# EAGLE schematic masterClock (EAGLE 9.0.0)
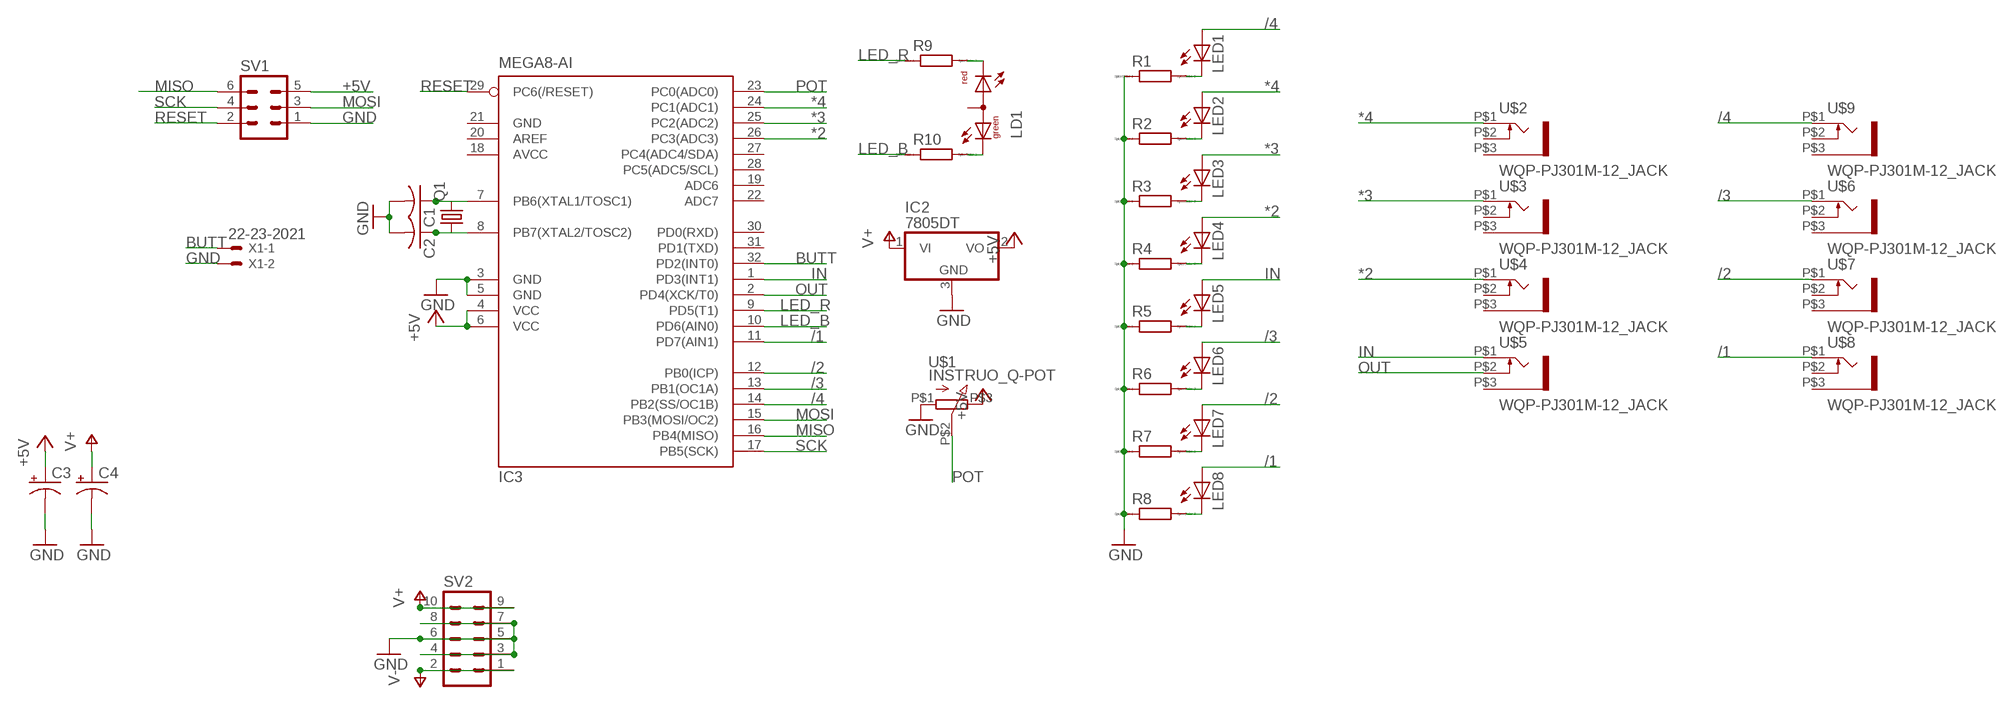
[diagram p0: schematic, sheet 1]

## Parts
C1  C-USC0805  [C0805]
C2  C-USC0805  [C0805]
C3  CPOL-US153CLV-0505  [153CLV-0505]
C4  CPOL-US153CLV-0505  [153CLV-0505]
IC2  7805DT  [TO252]
IC3  MEGA8-AI  [TQFP32-08]
LD1  DUOLED-RG-A  [DUOLED-A-5MM]
LED1  LED5MM  [LED5MM]
LED2  LED5MM  [LED5MM]
LED3  LED5MM  [LED5MM]
LED4  LED5MM  [LED5MM]
LED5  LED5MM  [LED5MM]
LED6  LED5MM  [LED5MM]
LED7  LED5MM  [LED5MM]
LED8  LED5MM  [LED5MM]
Q1  CRYSTALHC49UP  [HC49UP]
R1  R  [R0805]
R2  R  [R0805]
R3  R  [R0805]
R4  R  [R0805]
R5  R  [R0805]
R6  R  [R0805]
R7  R  [R0805]
R8  R  [R0805]
R9  R  [R0805]
R10  R  [R0805]
SV1  MA03-2  [MA03-2]
SV2  MA05-2  [MA05-2]
U$1  INSTRUO_Q-POT  [INSTRUO_Q-POT]
U$2  WQP-PJ301M-12_JACK  [WQP-PJ301M-12_JACK]
U$3  WQP-PJ301M-12_JACK  [WQP-PJ301M-12_JACK]
U$4  WQP-PJ301M-12_JACK  [WQP-PJ301M-12_JACK]
U$5  WQP-PJ301M-12_JACK  [WQP-PJ301M-12_JACK]
U$6  WQP-PJ301M-12_JACK  [WQP-PJ301M-12_JACK]
U$7  WQP-PJ301M-12_JACK  [WQP-PJ301M-12_JACK]
U$8  WQP-PJ301M-12_JACK  [WQP-PJ301M-12_JACK]
U$9  WQP-PJ301M-12_JACK  [WQP-PJ301M-12_JACK]
X1  22-23-2021  [22-23-2021]

## Nets
*2: IC3.26(PC3(ADC3)) LED4.A U$4.P$1
*3: IC3.25(PC2(ADC2)) LED3.A U$3.P$1
*4: IC3.24(PC1(ADC1)) LED2.A U$2.P$1
+5V: C3.+ IC2.2(VO) IC3.4(VCC) IC3.6(VCC) SV1.5 U$1.P$3
/1: IC3.11(PD7(AIN1)) LED8.A U$8.P$1
/2: IC3.12(PB0(ICP)) LED7.A U$7.P$1
/3: IC3.13(PB1(OC1A)) LED6.A U$6.P$1
/4: IC3.14(PB2(SS/OC1B)) LED1.A U$9.P$1
BUTT: IC3.32(PD2(INT0)) X1.1
GND: C1.2 C2.2 C3.- C4.- IC2.3(GND) IC3.3(GND) IC3.5(GND) R1.1 R2.1 R3.1 R4.1 R5.1 R6.1 R7.1 R8.1 SV1.1 SV2.3 SV2.4 SV2.5 SV2.6 SV2.7 SV2.8 U$1.P$1 X1.2
IN: IC3.1(PD3(INT1)) LED5.A U$5.P$1
LED_B: IC3.10(PD6(AIN0)) R10.1
LED_R: IC3.9(PD5(T1)) R9.1
MISO: IC3.16(PB4(MISO)) SV1.6
MOSI: IC3.15(PB3(MOSI/OC2)) SV1.3
N$1: LED1.K(C) R1.2
N$2: LED2.K(C) R2.2
N$3: LED3.K(C) R3.2
N$4: LED4.K(C) R4.2
N$5: LED5.K(C) R5.2
N$6: LED6.K(C) R6.2
N$7: LED7.K(C) R7.2
N$8: LED8.K(C) R8.2
N$9: LD1.CR R9.2
N$10: LD1.CX(CG) R10.2
N$11: C1.1 IC3.7(PB6(XTAL1/TOSC1)) Q1.2
N$12: C2.1 IC3.8(PB7(XTAL2/TOSC2)) Q1.1
OUT: IC3.2(PD4(XCK/T0)) U$5.P$2
POT: IC3.23(PC0(ADC0)) U$1.P$2
RESET: IC3.29(PC6(/RESET)) SV1.2
SCK: IC3.17(PB5(SCK)) SV1.4
V+: C4.+ IC2.1(VI) SV2.9 SV2.10
V-: SV2.1 SV2.2
Unconnected: IC3.19(ADC6) IC3.20(AREF) IC3.22(ADC7) IC3.27(PC4(ADC4/SDA)) IC3.28(PC5(ADC5/SCL)) IC3.30(PD0(RXD)) IC3.31(PD1(TXD)) LD1.A U$2.P$2 U$2.P$3 U$3.P$2 U$3.P$3 U$4.P$2 U$4.P$3 U$5.P$3 U$6.P$2 U$6.P$3 U$7.P$2 U$7.P$3 U$8.P$2 U$8.P$3 U$9.P$2 U$9.P$3

## Power pins joined to a net without a drawn wire
AVCC: IC3.18(AVCC)
GND: IC3.21(GND)

## Library data of the parts
C1 C2 = rcl:C-US: CAPACITOR, American symbol; SPICEPREFIX: C
C3 C4 = rcl:CPOL-US: POLARIZED CAPACITOR, American symbol; SPICEPREFIX: C
IC2 = linear:78*: Positive VOLTAGE REGULATOR Source: http://cache.national.com/ds/LM/LM78L05.pdf http://www.fairchildsemi.com/ds/LM/LM7805.pdf
IC3 = atmel:MEGA8: MICROCONTROLLER 8 Kbytes FLASH, 1 kbytes SRAM, 512 bytes EEPROM, USART, 6-channel 10 bit ADC, 2-channel 8 bit ADC Pin compatible with Atmega48, ATMega88, ATMega168 Source: avr.lbr; MPN: ATMEGA8-16AU; OC_FARNELL: 9171371; OC_NEWARK: 73M8863
LD1 = led:DUOLED-RG-A: DUO LED 2 colors (red/green), 5 mm, round, common Anode www.ligitek.com or other producers.
LED1-LED8 = led:LED: LED OSRAM: - CHIPLED LG R971, LG N971, LY N971, LG Q971, LY Q971, LO R971, LY R971 LH N974, LH R974 LS Q976, LO Q976, LY Q976 LO Q996 - Hyper CHIPLED LW Q18S LB Q993, LB Q99A, LB R99A - SideLED LS A670, LO A670, LY A670, LG A670, LP A670 LB A673, LV A673, LT A673, LW A673 LH A674 LY A675 LS A676, LA A676, LO A676, LY A676, LW A676 LS A679, LY A679, LG A679 - Hyper Micro SIDELED® LS Y876, LA Y876, LO Y876, LY Y876 LT Y87S - SmartLED LW L88C, LW L88S LB L89C, LB L89S, LG L890 LS L89K, LO L89K, LY L89K LS L896, LA L896, LO L896, LY L896 - TOPLED LS T670, LO T670, LY T670, LG T670, LP T670 LSG T670, LSP T670, LSY T670, LOP T670, LYG T670 LG T671, LOG T671, LSG T671 LB T673, LV T673, LT T673, LW T673 LH T674 LS T676, LA T676, LO T676, LY T676, LB T676, LH T676, LSB T676, LW T676 LB T67C, LV T67C, LT T67C, LS T67K, LO T67K, LY T67K, LW E67C LS E67B, LA E67B, LO E67B, LY E67B, LB E67C, LV E67C, LT E67C LW T67C LS T679, LY T679, LG T679 LS T770, LO T770, LY T770, LG T770, LP T770 LB T773, LV T773, LT T773, LW T773 LH T774 LS E675, LA E675, LY E675, LS T675 LS T776, LA T776, LO T776, LY T776, LB T776 LHGB T686 LT T68C, LB T68C - Hyper Mini TOPLED® LB M676 - Mini TOPLED Santana® LG M470 LS M47K, LO M47K, LY M47K Source: http://www.osram.convergy.de LUXEON: - LUMILED® LXK2-PW12-R00, LXK2-PW12-S00, LXK2-PW14-U00, LXK2-PW14-V00 LXK2-PM12-R00, LXK2-PM12-S00, LXK2-PM14-U00 LXK2-PE12-Q00, LXK2-PE12-R00, LXK2-PE12-S00, LXK2-PE14-T00, LXK2-PE14-U00 LXK2-PB12-K00, LXK2-PB12-L00, LXK2-PB12-M00, LXK2-PB14-N00, LXK2-PB14-P00, LXK2-PB14-Q00 LXK2-PR12-L00, LXK2-PR12-M00, LXK2-PR14-Q00, LXK2-PR14-R00 LXK2-PD12-Q00, LXK2-PD12-R00, LXK2-PD12-S00 LXK2-PH12-R00, LXK2-PH12-S00 LXK2-PL12-P00, LXK2-PL12-Q00, LXK2-PL12-R00 Source: www.luxeon.com KINGBRIGHT: KA-3528ASYC Source: www.kingbright.com
Q1 = crystal:CRYSTAL: CRYSTAL; OC_FARNELL: unknown; OC_NEWARK: unknown
R1-R10 = eagle-ltspice:R: RESISTOR, European symbol; SPICEMODEL: NONE; SPICEPREFIX: R
SV1 = con-lstb:MA03-2: PIN HEADER; OC_FARNELL: unknown; OC_NEWARK: unknown
SV2 = con-lstb:MA05-2: PIN HEADER; OC_FARNELL: unknown; OC_NEWARK: unknown
U$1 = Pure_VCO_SMD_V2_2:INSTRUO_Q-POT
U$2-U$9 = thonkiconn:WQP-PJ301M-12_JACK
X1 = con-molex:22-23-2021: .100" (2.54mm) Center Header - 2 Pin; MF: MOLEX; MPN: 22-23-2021; OC_FARNELL: 1462926; OC_NEWARK: 25C3832